# EAGLE design analogBoardV1 (EAGLE 6.4)
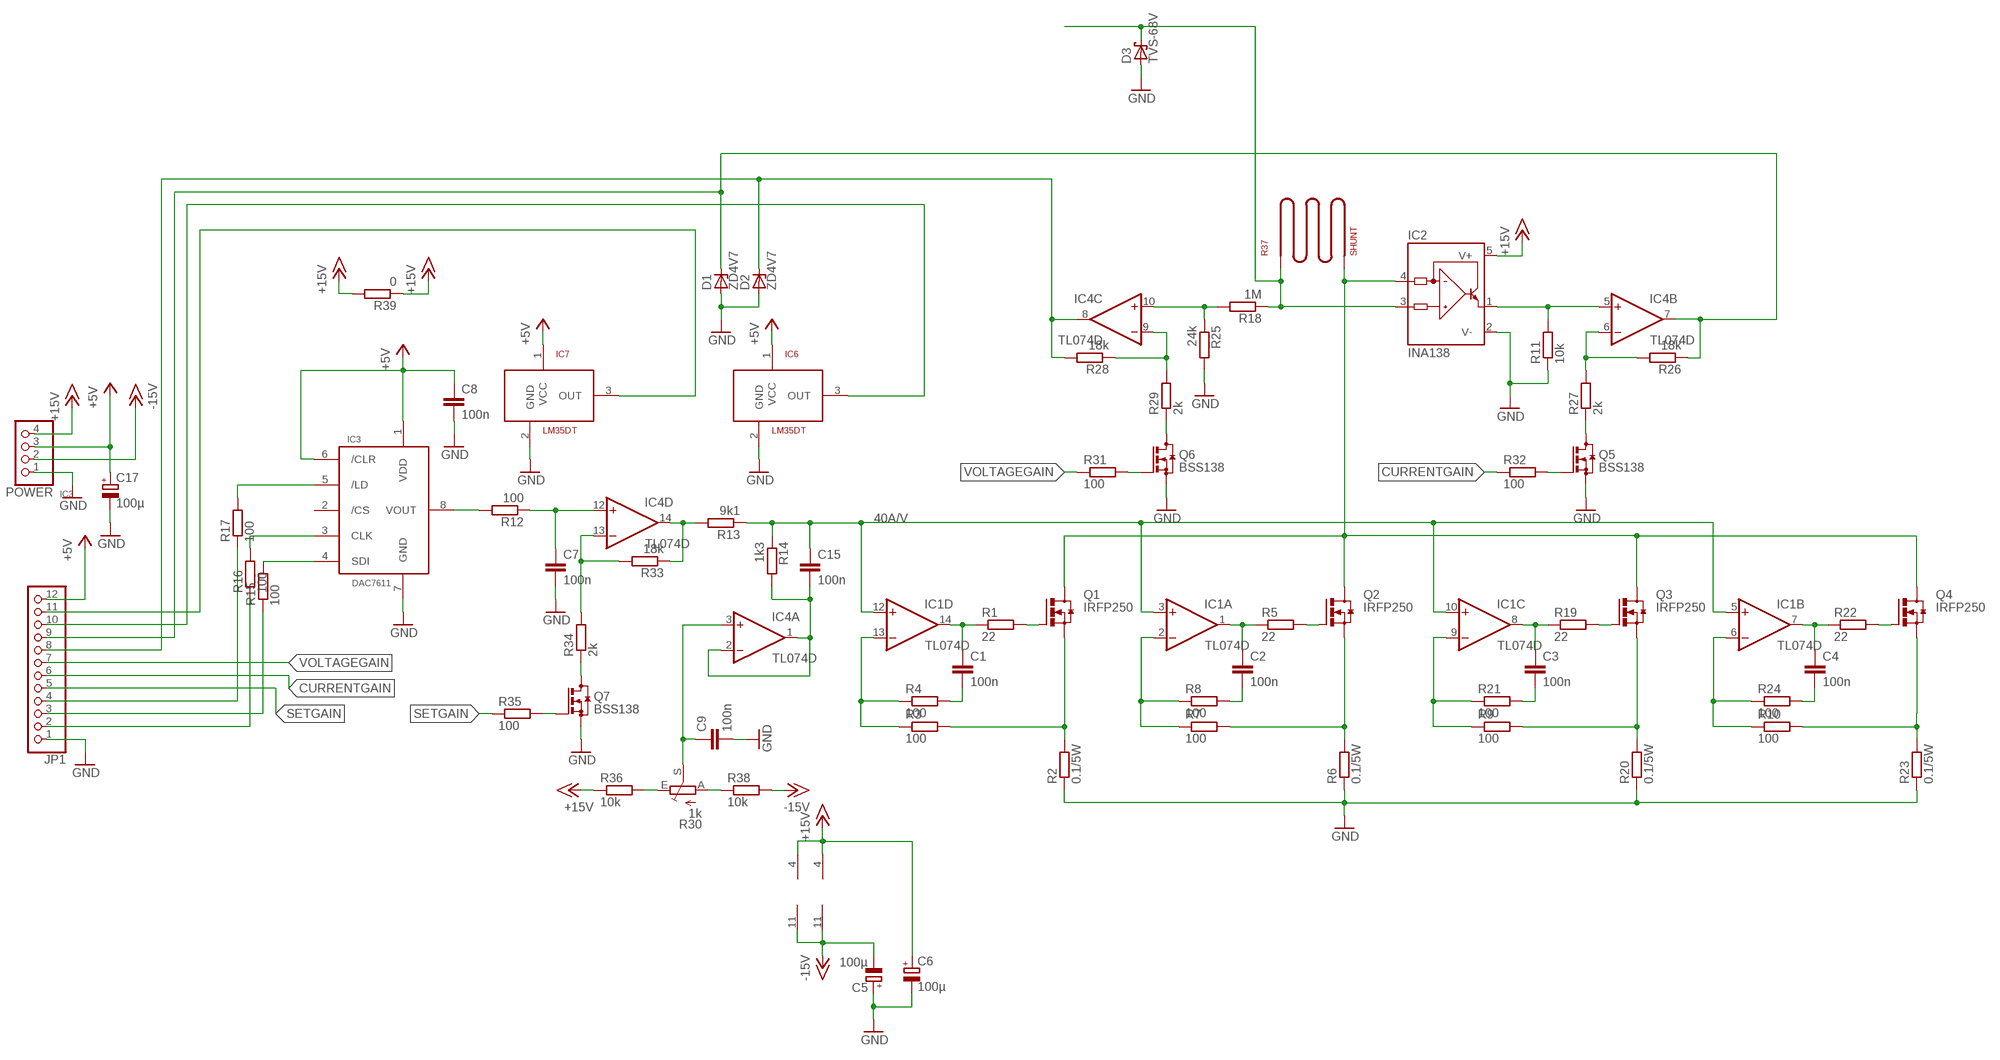
[diagram p0: schematic, sheet 1]

## Parts
C1  100n  C-EUC0603K  [C0603K]
C2  100n  C-EUC0603K  [C0603K]
C3  100n  C-EUC0603K  [C0603K]
C4  100n  C-EUC0603K  [C0603K]
C5  100µ  CPOL-EUE2.5-6  [E2,5-6]
C6  100µ  CPOL-EUE2.5-6  [E2,5-6]
C7  100n  C-EUC0603K  [C0603K]
C8  100n  C-EUC0603K  [C0603K]
C9  100n  C-EUC0603K  [C0603K]
C15  100n  C-EUC0603K  [C0603K]
C17  100µ  CPOL-EUE2.5-6  [E2,5-6]
D1  ZD4V7  ZENER-DIODESOT23  [SOT23]
D2  ZD4V7  ZENER-DIODESOT23  [SOT23]
D3  TVS-68V  SCHOTTKY-DIODECB429-15  [CB429-15]
IC1  TL074D  [SO14]
IC2  INA138  [SOT23-5]
IC3  DAC7611  [SO8]
IC4  TL074D  [SO14]
IC6  LM35DT  [TO220V]
IC7  LM35DT  [TO220V]
JP1  PINHD-1X12  [1X12]
POWER  PINHD-1X4  [1X04]
Q1  IRFP250  [TO-247AD-V]
Q2  IRFP250  [TO-247AD-V]
Q3  IRFP250  [TO-247AD-V]
Q4  IRFP250  [TO-247AD-V]
Q5  BSS138  BSS123  [SOT23]
Q6  BSS138  BSS123  [SOT23]
Q7  BSS138  BSS123  [SOT23]
R1  22  R-EU_R0603  [R0603]
R2  0.1/5W  5WAXIAL  [5WAXIAL]
R3  100  R-EU_R0603  [R0603]
R4  100  R-EU_R0603  [R0603]
R5  22  R-EU_R0603  [R0603]
R6  0.1/5W  5WAXIAL  [5WAXIAL]
R7  100  R-EU_R0603  [R0603]
R8  100  R-EU_R0603  [R0603]
R9  100  R-EU_R0603  [R0603]
R10  100  R-EU_R0603  [R0603]
R11  10k  R-EU_R0603  [R0603]
R12  100  R-EU_R0603  [R0603]
R13  9k1  R-EU_R0603  [R0603]
R14  1k3  R-EU_R0603  [R0603]
R15  100  R-EU_R0603  [R0603]
R16  100  R-EU_R0603  [R0603]
R17  100  R-EU_R0603  [R0603]
R18  1M  R-EU_R0603  [R0603]
R19  22  R-EU_R0603  [R0603]
R20  0.1/5W  5WAXIAL  [5WAXIAL]
R21  100  R-EU_R0603  [R0603]
R22  22  R-EU_R0603  [R0603]
R23  0.1/5W  5WAXIAL  [5WAXIAL]
R24  100  R-EU_R0603  [R0603]
R25  24k  R-EU_R0603  [R0603]
R26  18k  R-EU_R0603  [R0603]
R27  2k  R-EU_R0603  [R0603]
R28  18k  R-EU_R0603  [R0603]
R29  2k  R-EU_R0603  [R0603]
R30  1k  TRIM_EU-RJ9W  [RJ9W]
R31  100  R-EU_R0603  [R0603]
R32  100  R-EU_R0603  [R0603]
R33  18k  R-EU_R0603  [R0603]
R34  2k  R-EU_R0603  [R0603]
R35  100  R-EU_R0603  [R0603]
R36  10k  R-EU_R0603  [R0603]
R37  SHUNT  [COPPERSHUNT]
R38  10k  R-EU_R0603  [R0603]
R39  0  R-EU_R1206  [R1206]

## Nets
10: IC4.9(C:-IN) R28.1 R29.2
+5V: C8.1 C17.+ IC3.1(VDD) IC3.6(/CLR) IC6.1(VCC) IC7.1(VCC) JP1.12 POWER.3
+15V: C6.+ IC1.4(P:V+) IC2.5(V+) IC4.4(P:V+) POWER.4 R36.1 R39.1 R39.2
-15V: C5.- IC1.11(P:V-) IC4.11(P:V-) POWER.2 R38.2
CURRENTGAIN: JP1.6 R32.1
GND: C5.+ C6.- C7.2 C8.2 C9.2 C17.- D1.1(A) D2.1(A) D3.A IC2.2(V-) IC3.7(GND) IC6.2(GND) IC7.2(GND) JP1.1 POWER.1 Q5.2(S) Q6.2(S) Q7.2(S) R2.1 R6.1 R11.1 R20.1 R23.1 R25.2
N$1: C1.1 IC1.14(D:OUT) R1.1
N$2: Q1.G R1.2
N$3: Q1.S R2.2 R3.2
N$4: C1.2 R4.2
N$5: IC1.13(D:-IN) R3.1 R4.1
N$6: C2.1 IC1.1(A:OUT) R5.1
N$7: Q2.G R5.2
N$8: Q2.S R6.2 R7.2
N$9: IC1.2(A:-IN) R7.1 R8.1
N$10: C2.2 R8.2
N$11: D3.C IC2.3(IN+) R18.1 R37.P$1
N$12: IC2.1(OUT) IC4.5(B:+IN) R11.2
N$13: IC3.8(VOUT) R12.2
N$14: C3.1 IC1.8(C:OUT) R19.1
N$15: Q3.G R19.2
N$16: C7.1 IC4.12(D:+IN) R12.1
N$17: IC4.14(D:OUT) R13.2 R33.1
N$18: IC3.4(SDI) R15.2
N$19: Q3.S R9.2 R20.2
N$20: IC1.9(C:-IN) R9.1 R21.1
N$21: IC3.3(CLK) R16.2
N$22: IC3.5(/LD) R17.2
N$23: C3.2 R21.2
N$24: C4.1 IC1.7(B:OUT) R22.1
N$25: D1.3(C) IC4.7(B:OUT) JP1.9 R26.1
N$26: Q4.G R22.2
N$27: Q4.S R10.2 R23.2
N$28: IC1.6(B:-IN) R10.1 R24.1
N$29: C4.2 R24.2
N$30: C15.2 IC4.1(A:OUT) IC4.2(A:-IN) R14.2
N$31: C15.1 IC1.3(A:+IN) IC1.5(B:+IN) IC1.10(C:+IN) IC1.12(D:+IN) R13.1 R14.1
N$32: R30.A R38.1
N$33: IC4.10(C:+IN) R18.2 R25.1
N$34: R30.E R36.2
N$36: IC4.6(B:-IN) R26.2 R27.2
N$37: Q5.3(D) R27.1
N$38: Q6.3(D) R29.1
N$39: D2.3(C) IC4.8(C:OUT) JP1.8 R28.2
N$40: Q5.1(G) R32.2
N$41: Q6.1(G) R31.2
N$42: IC4.13(D:-IN) R33.2 R34.2
N$43: Q7.3(D) R34.1
N$44: Q7.1(G) R35.2
N$45: C9.1 IC4.3(A:+IN) R30.S
N$49: JP1.4 R17.1
N$50: JP1.2 R16.1
N$51: JP1.3 R15.1
N$53: IC6.3(OUT) JP1.10
N$54: IC7.3(OUT) JP1.11
POS_INPUT1: IC2.4(IN-) Q1.D Q2.D Q3.D Q4.D R37.P$2
SETGAIN: JP1.5 R35.1
VOLTAGEGAIN: JP1.7 R31.1
Unconnected: IC3.2(/CS)

## Notes on the sheet
- 40A/V

## Library data of the parts
C1-C4 C7-C9 C15 = rcl:C-EU: CAPACITOR, European symbol
C5 C6 C17 = rcl:CPOL-EU: POLARIZED CAPACITOR, European symbol
D1 D2 = diode:ZENER-DIODE: Z-Diode
D3 = diode:SCHOTTKY-DIODE: Schottky Diode
IC1 IC4 = linear:TL074: OP AMP
IC2 = burr-brown:INA138: High-Side Measurement Current Shunt Monitor; MF: TEXAS INSTRUMENTS; MPN: INA138NA/250; OC_FARNELL: 1564888; OC_NEWARK: 80K5906
IC3 = customAnalog:DAC7611
IC6 IC7 = customSensors:LM35DT
JP1 = pinhead:PINHD-1X12: PIN HEADER
POWER = pinhead:PINHD-1X4: PIN HEADER
Q1-Q4 = transistor-power:IRFP25*: 33A/27A, 200V/150V, 0.085/0.012 Ohm, N-Channel Power MOSFET Source: Fairchild Semiconductor Corporation
Q5-Q7 = transistor-small-signal:BSS123: N-CHANNEL MOS FET
R1 R3-R5 R7-R19 R21 R22 R24-R29 R31-R36 R38 R39 = resistor:R-EU_: RESISTOR, European symbol
R2 R6 R20 R23 = resistormod:5WAXIAL
R30 = pot:TRIM_EU-: POTENTIOMETER
R37 = customResistor:SHUNT

## Board
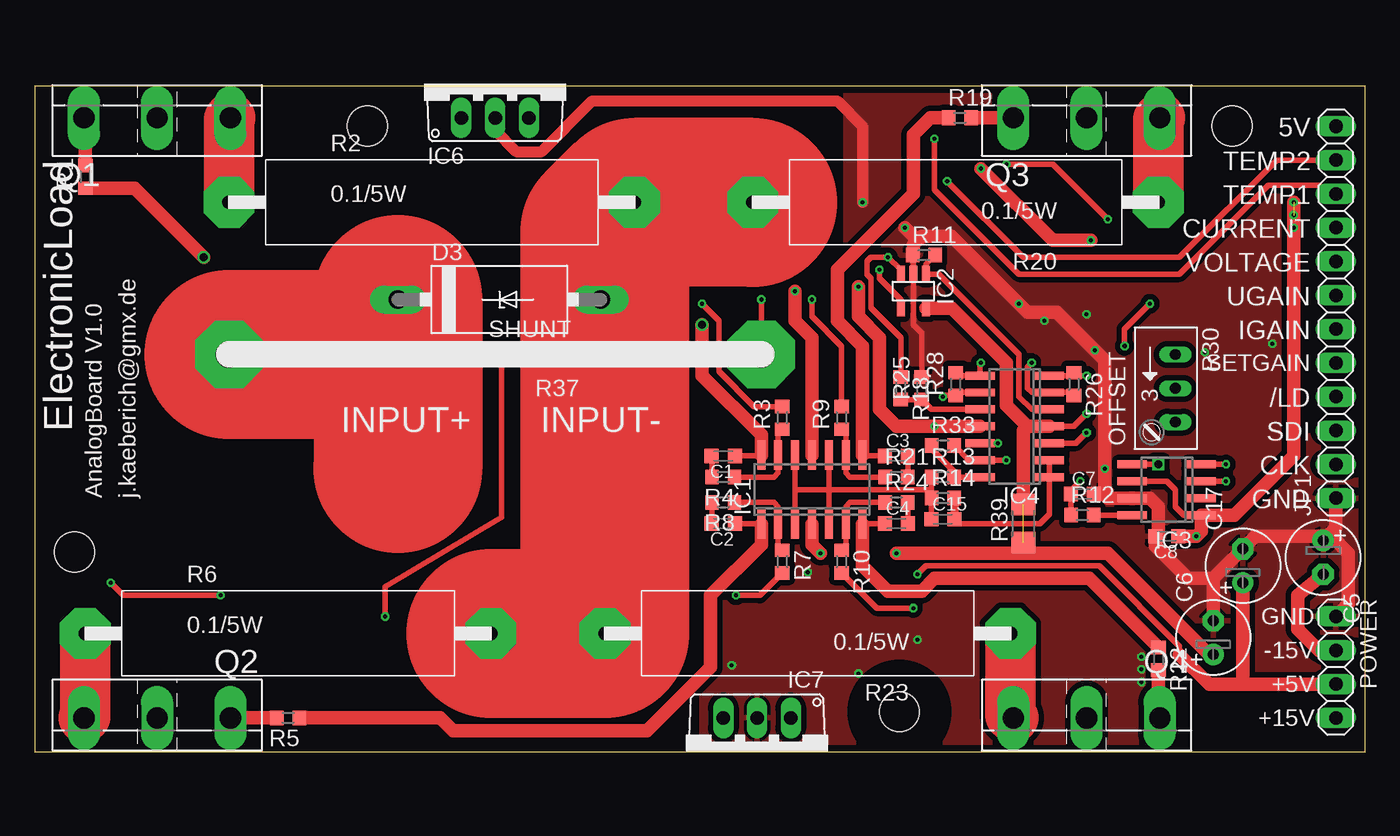
[diagram p1: board, top side]
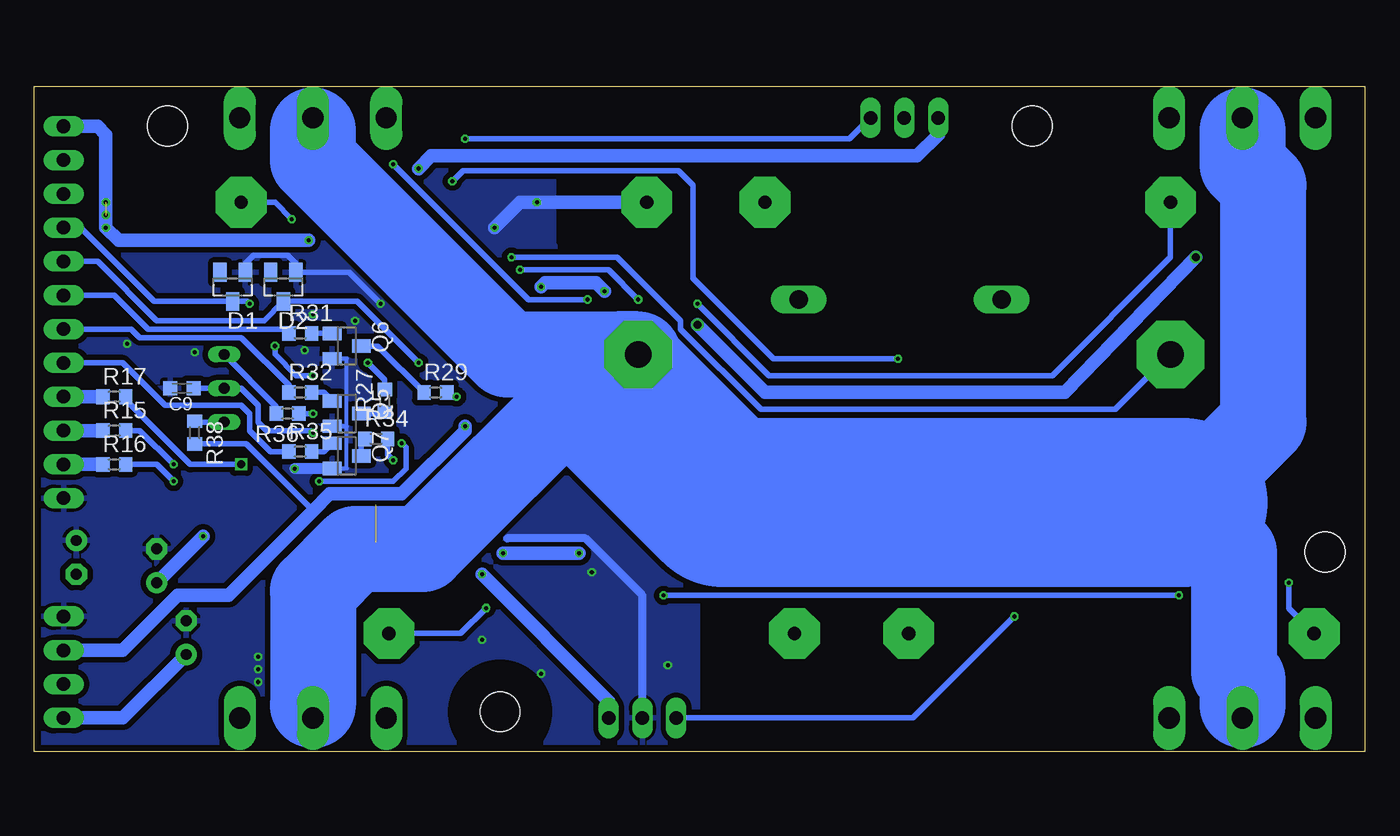
[diagram p2: board, bottom side, seen from below]

Size 100 x 50 mm. Coordinates in mm from the lower left corner, seen from the top.
Outline: 0,0 100,0 100,50 0,50 0,0
Copper layers (1*16): Top 0.035mm / dielectric 1.6mm / Bottom 0.035mm
Design rules "Elecrow_2-layer_PCB_eagle_rule": minimum track width 6mil, minimum drill 12mil, track to track 6mil, track to pad 6mil, pad to pad 6mil, via to via 8mil, smd to smd 0mil, copper to edge 20mil, drill to drill 10mil, minimum pad ring 6mil, minimum via ring 6mil, stop-mask expansion 0mil, vias tented up to drill 100mil, thermal gap 10mil
Holes 3 mm at 90,47 65,3 25,47 3,15
tRestrict: area 62,0 to 68,6
bRestrict: area 62,0 to 68,6

### Footprints (pad centres in the part's own frame; a part is rotated, then mirrored left to right if it is on the bottom)
C0603K = smd 1.05 x 1.08: 1 -0.875,0; 2 0.875,0
E2,5-6 = drill 0.813 pad 1.6: + -1.27,0 | drill 0.813 pad 1.6 octagon: - 1.27,0
SOT23 = smd 1 x 1.4: 1 -0.95,-1.1; 2 0.95,-1.1; 3 0,1.1
CB429-15 = drill 1.397 long: A 7.62,0; C -7.62,0
SO14 = smd 0.6 x 2.2: 1 -3.81,-2.6; 2 -2.54,-2.6; 3 -1.27,-2.6; 4 0,-2.6; 5 1.27,-2.6; 6 2.54,-2.6; 7 3.81,-2.6; 8 3.81,2.6; 9 2.54,2.6; 10 1.27,2.6; 11 0,2.6; 12 -1.27,2.6; 13 -2.54,2.6; 14 -3.81,2.6
SOT23-5 = smd 0.6 x 1.2: 1 -0.95,-1.306; 2 0,-1.306; 3 0.95,-1.306; 4 0.95,1.306; 5 -0.95,1.306
SO8 = smd 0.6 x 2.2: 1 -1.905,-2.6; 2 -0.635,-2.6; 3 0.635,-2.6; 4 1.905,-2.6; 5 1.905,2.6; 6 0.635,2.6; 7 -0.635,2.6; 8 -1.905,2.6
TO220V = drill 1.016 long: 1 -2.54,-2.54; 2 0,-2.54; 3 2.54,-2.54
1X12 = drill 1.016 long: 1 -13.97,0; 2 -11.43,0; 3 -8.89,0; 4 -6.35,0; 5 -3.81,0; 6 -1.27,0; 7 1.27,0; 8 3.81,0; 9 6.35,0; 10 8.89,0; 11 11.43,0; 12 13.97,0
1X04 = drill 1.016 long: 1 -3.81,0; 2 -1.27,0; 3 1.27,0; 4 3.81,0
TO-247AD-V = drill 1.6 long: D 0,-2.54; G -5.5,-2.54; S 5.5,-2.54
R0603 = smd 1 x 1.1: 1 -0.85,0; 2 0.85,0
5WAXIAL = drill 1 pad 3.81 octagon: 1 15.24,0; 2 -15.24,0
RJ9W = drill 0.813 long: A 2.54,0.635; E -2.54,0.635; S 0,0.635
COPPERSHUNT = drill 2 pad 5.08 octagon: P$1 20,0; P$2 -20,0
R1206 = smd 1.6 x 1.803: 1 -1.422,0; 2 1.422,0

### Placement (x,y rotation side)
C1  51.75,22.23 180 top
C2  51.75,17.14 180 top
C3  64.77,22.23 0 top
C4  64.77,17.14 0 top
C5  96.84,14.61 270 top
C6  88.58,8.57 90 top
C7  78.74,19.37 0 top
C8  85.09,16.19 180 top
C9  88.9,27.3 180 bottom
C15  68.26,17.46 0 top
C17  90.81,13.97 90 top
D1  85.09,34.92 180 bottom
D2  81.28,34.92 180 bottom
D3  34.92,33.97 0 top
IC1  58.42,19.68 0 top
IC2  66.04,34.61 180 top
IC3  85.09,19.68 90 top
IC4  73.66,24.45 90 top
IC6  34.61,50.16 0 top
IC7  54.29,0 180 top
JP1  97.79,33.02 90 top
POWER  97.79,6.35 270 top
Q1  9.21,50.16 0 top
Q2  9.21,0 180 top
Q3  79.06,50.16 0 top
Q4  79.06,0 180 top
Q5  76.52,25.4 270 bottom
Q6  76.52,30.48 270 bottom
Q7  76.52,22.23 270 bottom
R1  3.81,43.18 90 top
R2  29.84,41.27 0 top
R3  56.2,25.08 90 top
R4  51.75,20.64 180 top
R5  19.05,2.54 180 top
R6  19.05,8.89 0 top
R7  56.2,14.29 270 top
R8  51.75,18.73 180 top
R9  60.64,25.08 90 top
R10  60.64,14.29 270 top
R11  66.83,37.31 0 top
R12  78.74,17.78 0 top
R13  68.26,20.64 0 top
R14  68.26,19.05 0 top
R15  93.98,24.13 0 bottom
R16  93.98,21.59 0 bottom
R17  93.98,26.67 0 bottom
R18  65.09,27.3 270 top
R19  69.53,47.62 0 top
R20  69.22,41.27 180 top
R21  64.77,20.64 0 top
R22  84.45,6.99 270 top
R23  58.1,8.89 180 top
R24  64.77,18.73 0 top
R25  66.67,27.3 90 top
R26  78.11,27.62 270 top
R27  73.66,26.35 90 bottom
R28  69.22,27.62 90 top
R29  69.85,26.99 0 bottom
R30  85.09,27.3 270 top
R31  80.01,31.43 0 bottom
R32  80.01,26.99 0 bottom
R33  68.26,23.02 0 top
R34  74.3,23.5 0 bottom
R35  80.01,22.54 0 bottom
R36  80.96,25.4 180 bottom
R37  34.61,29.84 180 top
R38  87.95,23.97 270 bottom
R39  74.3,17.14 90 top

### Tracks (layer width: path | path; a pad name or v marks a point on that pad's centre or on a via)
10  (via drill 0.3)
  Top 0.406: IC4.9 69.43,26.99 R28.1 68.36,26.77 v68.26,26.67
  Bottom 0.406: v68.26,26.67 68.68,26.67 R29.2
+5V  (via drill 0.3)  (1 unrouted)
  Top 0.406: v66.36,13.34 66.99,13.97 80.01,13.97 86.04,7.94 86.04,7.3 | IC3.6 85.09,20.32 85.72,19.68 85.72,18.41 86.36,17.78 IC3.1
  Top 1.016: POWER.3 90.81,5.08 | 90.81,5.08 C17.+ | v71.12,43.81 76.52,38.42 v79.38,38.42 | 86.04,7.3 88.27,5.08 90.81,5.08 | C8.1 v87.31,16.19 87.69,16.57 IC3.1 90.17,17.78 94.61,22.23 v94.61,39.37 v94.61,41.27
  Bottom 1.016: IC6.1 32.07,46.35 33.66,44.77 70.17,44.77 v71.12,43.81 | v79.38,38.42 93.66,38.42 v94.61,39.37 94.61,46.35 95.25,46.99 JP1.12 | IC7.1 56.83,3.81 v66.36,13.34 | C17.+ v87.31,16.19
  other vias: 94.61,40.32
+15V  (via drill 0.3)  (1 unrouted)
  Top 0.406: v79.06,25.4 78.11,24.45 IC4.4
  Top 1.016: IC1.4 58.42,15.56 v59.05,14.92 | v64.77,14.92 74.3,14.92 | 74.3,14.92 80.64,14.92 88.58,6.99 C6.+ | IC4.4 74.61,24.45 | 74.61,24.45 73.03,26.04 73.03,29.21 68.93,33.3 IC2.5 67.03,33.34 | 74.61,24.45 74.3,24.13 R39.2 | R39.1 74.3,14.92
  Bottom 0.406: R36.1 v79.06,25.4
  Bottom 1.016: v59.05,14.92 v64.77,14.92 | POWER.4 93.34,2.54 C6.+
-15V  (via drill 0.3)
  Top 1.016: v57.15,34.61 57.15,32.38 58.42,31.11 IC1.11 | v61.91,34.92 61.91,32.7 63.5,31.11 63.5,25.72 64.77,24.45 v67.63,24.45 IC4.11 | POWER.2 96.52,7.62 94.93,9.21 94.93,11.75 C5.-
  Bottom 0.406: R38.2 84.08,23.12 79.06,18.1
  Bottom 1.016: v61.91,34.92 61.59,35.24 57.78,35.24 v57.15,34.61 | v67.63,24.45 67.63,24.13 72.39,19.37 77.79,19.37 79.06,18.1 85.41,11.75 89.22,11.75 93.34,7.62 POWER.2
CURRENTGAIN
  Bottom 0.406: R32.1 80.86,27.52 84.45,31.11 92.08,31.11 92.71,31.75 JP1.6
GND  (via drill 0.3)
  Top 0.406: R11.1 66.04,37.25 IC2.2 66.04,32.07 66.67,31.43 R25.2 | 80.57,20.32 80.64,20.32 80.49,20.48 | 79.93,19.05 C7.2 | v73.98,33.66 73.98,33.97 73.66,34.29
  Top 0.813: 80.43,20.54 80.49,20.48 | 66.36,38.42 66.04,38.1 | 66.04,37.36 R11.1 | IC6.2 34.61,46.67 36.2,45.09 38.1,45.09 41.91,48.9 60.33,48.9 62.23,46.99 v62.23,41.27
  Top 1.016: POWER.1 98.74,11.11 98.74,14.92 97.47,16.19 | 88.58,13.02 C17.- 91.76,16.19 96.52,16.19 | 88.58,13.02 C6.- | 66.04,38.1 66.04,37.36 | v65.41,39.37 66.36,38.42 66.67,38.73 68.9,38.73 v73.98,33.66 74.61,33.02 76.83,33.02 80.43,29.43 v80.43,21.27 80.43,20.54 80.43,19.27 | 96.52,16.19 97.47,16.19 | C5.+ 96.52,16.19 | 88.58,13.02 86.68,13.02 84.22,15.48 C8.2 84.45,16.43 84.45,18.41 83.82,19.05 IC3.7 80.64,19.05 80.43,19.27 | C7.2 80.33,19.37 80.43,19.27 | JP1.1 97.79,16.83 C5.+ | 97.47,16.19 97.16,15.88 C5.+
  Top 12.7: R6.1 R23.1 42.86,39.05 R2.1 R20.1
  Top 6.452: D3.A 42.55,38.73 42.86,39.05
  Bottom 0.305: 76.52,21.27 | 76.52,21.27 76.52,24.45 | 76.52,24.45 Q5.2 76.52,24.45 | 76.52,24.45 76.52,29.53 Q6.2 | 76.52,21.27 77.79,21.27
  Bottom 0.406: D1.1 84.14,36.67 83.5,37.31 80.96,37.31 80.33,36.67 D2.1 76.35,36.02 v73.98,33.66
  Bottom 0.61: IC7.2 54.29,11.75 58.58,16.03 64.45,16.03
  Bottom 0.813: Q7.2 v80.43,21.27
  Bottom 1.016: R20.1 v62.23,41.27 63.5,41.27 v65.41,39.37
  other vias: 66.36,8.41 61.91,5.87 75.88,32.38 79.06,32.86 79.69,30.16 87.95,30 93.03,30.64 83.19,5.24 83.19,7.14 83.19,6.19 58.1,13.49 52.39,6.51
  pour Top (isolate 0.406): 60.96,50.16 60.96,38.1 57.15,34.29 50.8,34.29 50.16,33.66 50.16,-0.64 100.33,-0.64 100.33,50.16
  pour Bottom (isolate 0.406): 60.96,50.16 60.96,38.1 57.15,34.29 50.8,34.29 50.16,33.66 50.16,-0.64 100.33,-0.64 100.33,50.16
N$1  (via drill 0.6)
  Top 0.406: C1.1 54.55,22.23 IC1.14
  Top 1.016: R1.1 7.52,42.33 v12.7,37.15 | v50.16,32.07 50.16,28.26 54.61,23.81 IC1.14
  Bottom 1.016: v12.7,37.15 22.54,26.99 45.09,26.99 v50.16,32.07
N$2
  Top 1.016: R1.2 3.81,47.52 Q1.G
N$3  (via drill 0.3)
  Top 0.406: R3.2 54.08,25.93 51.44,28.57 51.44,32.38 v50.16,33.66
  Top 3.81: R2.2 14.61,46.67 14.61,47.52 Q1.S
  Bottom 0.406: v50.16,33.66 44.77,28.26 23.5,28.26 14.61,37.15 R2.2
N$4
  Top 0.406: R4.2 50.9,22.2 C1.2
N$5
  Top 0.406: R4.1 55.56,20.64 55.88,20.95 IC1.13 55.88,23.91 R3.1
N$6
  Top 0.406: C2.1 54.55,17.14 IC1.1
  Top 1.016: R5.1 30.48,2.54 31.43,1.59 46.04,1.59 50.8,6.35 50.8,11.75 54.61,15.56 IC1.1
N$7
  Top 1.016: Q2.G R5.2
N$8  (via drill 0.3)
  Top 0.406: R7.2 54.51,11.75 v52.7,11.75 | v13.97,11.75 6.67,11.75 v5.71,12.7
  Top 3.81: R6.2 3.81,3.49 3.81,2.64 Q2.S
  Bottom 0.406: v52.7,11.75 v13.97,11.75 | v5.71,12.7 5.71,10.79 R6.2
N$9
  Top 0.406: R8.1 55.56,18.73 55.88,18.41 IC1.2 55.88,15.46 R7.1
N$10
  Top 0.406: R8.2 50.9,17.17 C2.2
N$11  (via drill 0.3)
  Top 0.406: IC2.3 65.09,36.19 v64.14,37.15 62.87,37.15 62.55,36.83 62.55,35.88 62.87,35.56 62.87,33.34 65.09,31.11 R18.1
  Top 12.7: R37.P$1 27.3,29.84 D3.C 27.3,21.27
  Bottom 0.406: R37.P$1 18.73,25.72 45.4,25.72 51.44,31.75 51.44,32.38 56.2,37.15 v64.14,37.15
N$12
  Top 0.406: R11.2 66.99,36.61 IC2.1 67.03,35.88 67.94,35.88 73.98,29.84 73.98,26.67 74.93,25.72 IC4.5
N$13
  Top 0.406: IC3.8 R12.2
N$14
  Top 0.406: C3.1 62.29,22.23 IC1.8
  Top 1.016: R19.1 67.31,47.62 66.04,46.35 66.04,41.91 60.33,36.2 60.33,32.38 62.23,30.48 IC1.8
N$15
  Top 1.016: R19.2 Q3.G
N$16  (via drill 0.3)
  Top 0.406: IC4.12 v72.39,23.18 | R12.1 77.89,19.34 C7.1 77.86,19.6 v78.58,20.32
  Bottom 0.406: v72.39,23.18 72.07,22.86 72.07,21.27 73.03,20.32 v78.58,20.32
N$17
  Top 0.406: IC4.14 R13.2 69.22,20.74 69.22,20.95 67.41,22.76 R33.1
N$18  (via drill 0.3)
  Top 0.406: IC3.4 v89.53,21.59
  Bottom 0.406: v89.53,21.59 92.08,24.13 R15.2
N$19  (via drill 0.3)
  Top 0.406: 60.96,26.25 R9.2 60.64,30.48 58.42,32.7 v58.42,33.97 | v73.03,44.13 76.52,44.13 v80.64,40.01
  Top 3.81: R20.2 84.45,46.67 84.45,47.52 Q3.S
  Bottom 0.406: v73.03,44.13 62.87,33.97 v58.42,33.97 | v80.64,40.01 81.92,41.27 R20.2
N$20
  Top 0.406: R21.1 61.28,20.64 60.96,20.95 IC1.9 60.96,23.91 R9.1
N$21  (via drill 0.3)
  Top 0.406: IC3.3 v89.53,20.32
  Bottom 0.406: v89.53,20.32 90.81,21.59 R16.2
N$22  (via drill 0.6)
  Top 0.406: IC3.5 v84.45,21.59
  Bottom 0.406: v84.45,21.59 88.27,21.59 93.13,26.45 R17.2
N$23
  Top 0.406: R21.2 65.62,22.2 C3.2
N$24
  Top 0.406: C4.1 62.29,17.14 IC1.7
  Top 1.016: R22.1 79.27,13.02 67.63,13.02 66.67,12.06 64.14,12.06 62.23,13.97 IC1.7
N$25  (via drill 0.3)
  Top 0.406: IC4.7 77.89,28.26 R26.1 78.32,28.26 v79.06,28.26 | v83.82,33.66 81.92,31.75 v81.92,30.48
  Bottom 0.406: JP1.9 96.52,39.37 90.97,33.83 D1.3 83.99,33.83 v83.82,33.66 | v79.06,28.26 80.33,28.26 81.92,29.84 v81.92,30.48
N$26
  Top 1.016: R22.2 84.45,2.64 Q4.G
N$27  (via drill 0.3)
  Top 0.406: R10.2 63.28,10.79 v66.04,10.79
  Top 3.81: R23.2 73.34,2.75 Q4.S
  Bottom 0.406: v66.04,10.79 67.94,8.89 R23.2
N$28
  Top 0.406: R24.1 61.28,18.73 60.96,18.41 IC1.6 60.96,15.46 R10.1
N$29
  Top 0.406: R24.2 65.62,17.17 C4.2
N$30
  Top 0.406: R14.2 69.14,19.02 | IC4.2 IC4.1 76.26,17.84 75.56,17.14 69.45,17.14 C15.2
  Top 0.61: 69.14,19.02 C15.2
N$31
  Top 0.406: IC1.12 57.15,19.68 | 57.15,19.68 IC1.3 | IC1.10 59.69,19.68 | 59.69,19.68 57.15,19.68 | IC1.5 59.69,19.68 | R13.1 R14.1 67.39,19.02 C15.1 67.39,19.68 59.69,19.68
N$32
  Bottom 0.406: R30.A 87.89,24.77 R38.1
N$33
  Top 0.406: R18.2 R25.1 67.41,25.72 IC4.10
N$34
  Bottom 0.406: R30.E 81.81,25.93 R36.2
N$36  (via drill 0.3)
  Top 0.406: v74.93,29.21 74.61,28.89 74.61,27.3 74.93,26.99 IC4.6 77.89,26.99 R26.2
  Bottom 0.406: v74.93,29.21 73.66,27.94 R27.2
N$37
  Bottom 0.406: Q5.3 73.76,25.4 R27.1
N$38
  Bottom 0.406: Q6.3 74.19,30.48 R29.1
N$39  (via drill 0.3)
  Top 0.406: R28.2 69.43,28.26 IC4.8 71.06,29.15 v71.12,29.21
  Bottom 0.406: v71.12,29.21 75.73,33.83 D2.3 82.72,32.38 90.81,32.38 95.25,36.83 JP1.8
N$40
  Bottom 0.406: Q5.1 78.25,26.99 R32.2
N$41
  Bottom 0.406: R31.2 Q6.1
N$42  (via drill 0.3)
  Top 0.406: v73.03,21.91 IC4.13 70.22,21.91 R33.2
  Bottom 0.406: v73.03,21.91 73.44,22.33 R34.2
N$43
  Bottom 0.406: Q7.3 75.42,23.22 R34.1
N$44
  Bottom 0.406: Q7.1 78.25,22.54 R35.2
N$45  (via drill 0.3)
  Top 0.406: IC4.3 78.26,23.18 v79.06,23.97
  Bottom 0.406: v79.06,23.97 79.22,24.13 82.55,24.13 83.19,24.77 83.19,26.04 84.45,27.3 R30.S C9.1
N$49
  Bottom 1.016: JP1.4 R17.1
N$50
  Bottom 1.016: JP1.2 R16.1
N$51
  Bottom 1.016: JP1.3 R15.1
N$53  (via drill 0.3)
  Top 0.406: JP1.10 96.52,42.55 92.71,42.55 86.04,35.88 73.98,35.88 67.63,42.23 v67.63,46.04
  Bottom 0.406: v67.63,46.04 38.73,46.04 IC6.3
N$54  (via drill 0.3)
  Top 0.406: v35.08,29.53 35.08,17.62 26.35,12.38 v26.35,10.16 | v68.58,42.86 74.3,37.15 86.04,37.15 93.34,44.45 JP1.11
  Bottom 0.406: v68.58,42.86 67.79,43.66 51.59,43.66 50.48,42.55 50.48,35.56 44.45,29.53 v35.08,29.53 | v26.35,10.16 33.97,2.54 IC7.3
POS_INPUT1  (via drill 0.3)
  Top 0.406: v54.61,33.97 R37.P$2 | IC2.4 65.09,33.97 63.5,35.56 v63.5,36.2
  Bottom 0.406: v63.5,36.2 56.83,36.2 v54.61,33.97
  Bottom 12.7: 13.65,18.73 48.26,18.73 56.2,26.67
  Bottom 3.81: Q1.D 9.21,46.67 | Q3.D 79.06,46.67 | 79.06,3.49 Q4.D | 9.21,3.49 Q2.D
  Bottom 6.452: 9.21,46.67 9.21,44.13 7.62,42.55 7.62,24.77 13.65,18.73 9.84,14.92 9.84,6.03 9.21,5.4 9.21,3.49 | 79.06,46.67 79.06,44.45 64.45,29.84 56.2,29.84 | R37.P$2 56.2,29.84 | 79.06,3.49 79.06,12.06 75.88,15.24 70.8,15.24 58.42,27.62 | 58.42,27.62 56.2,29.84 | 56.2,26.67 57.47,26.67 58.42,27.62
SETGAIN
  Bottom 0.406: R35.1 82.23,22.54 83.82,24.13 83.82,25.4 84.45,26.04 90.17,26.04 93.34,29.21 JP1.5
VOLTAGEGAIN
  Bottom 0.406: JP1.7 93.98,34.29 91.44,31.75 81.18,31.75 R31.1

### Text on the board
tPlace: 5V | TEMP2 | ElectronicLoad | TEMP1 | CURRENT | VOLTAGE | UGAIN | IGAIN | SETGAIN | /LD | SDI | INPUT+ | INPUT- | OFFSET | CLK | GND | AnalogBoard V1.0 | j.kaeberich@gmx.de | GND | -15V | +5V | +15V